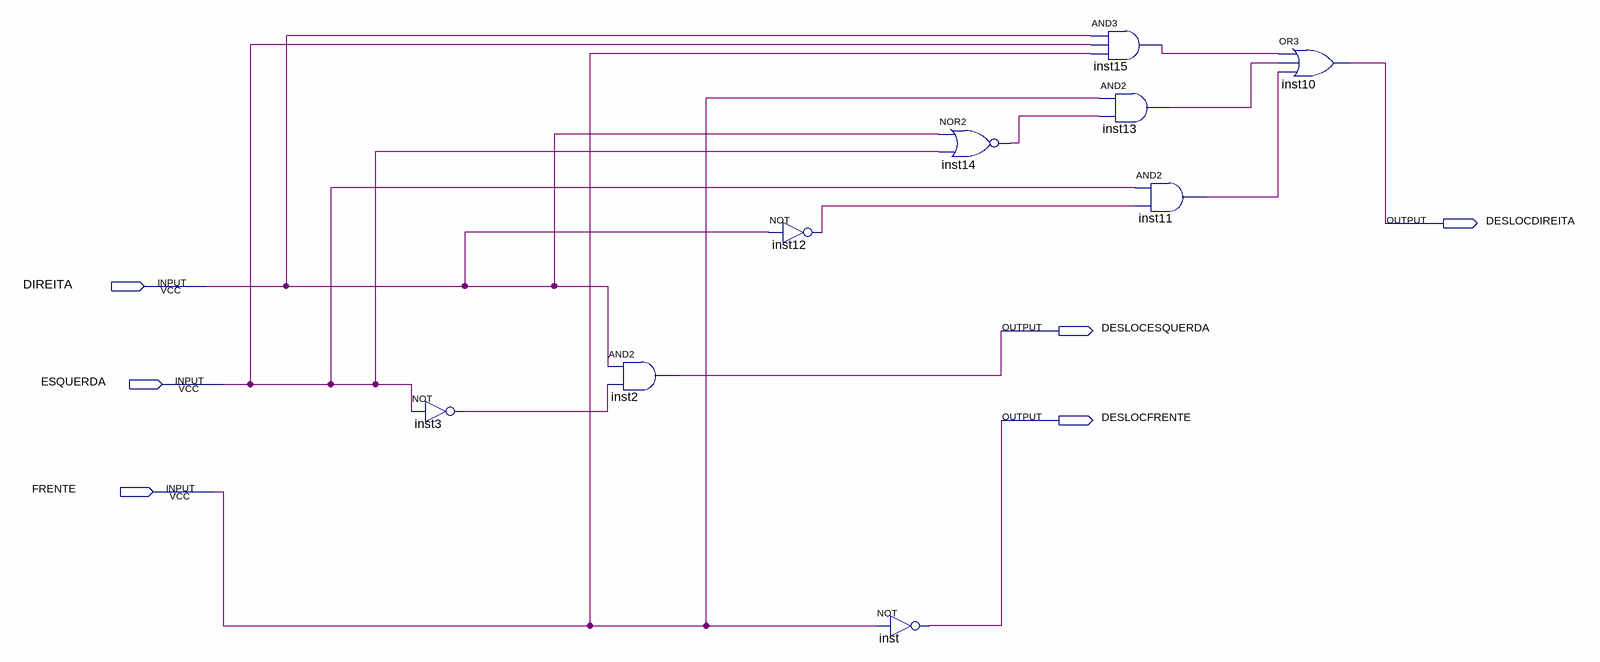
[diagram p0: schematic sheet]
// Quartus schematic Aula3.bdf as structural Verilog: 9 symbols, 6 pins
module Aula3 (
  input  DIREITA,
  input  ESQUERDA,
  input  FRENTE,
  output DESLOCDIREITA,
  output DESLOCESQUERDA,
  output DESLOCFRENTE
);

  wire inst3_out, inst11_out, inst12_out, inst13_out, inst14_out, inst15_out;

  not inst3 (inst3_out, ESQUERDA);
  and inst2 (DESLOCESQUERDA, DIREITA, inst3_out);
  not inst12 (inst12_out, DIREITA);
  nor inst14 (inst14_out, DIREITA, ESQUERDA);
  not inst (DESLOCFRENTE, FRENTE);
  and inst15 (inst15_out, DIREITA, ESQUERDA, FRENTE);
  and inst13 (inst13_out, FRENTE, inst14_out);
  and inst11 (inst11_out, ESQUERDA, inst12_out);
  or inst10 (DESLOCDIREITA, inst15_out, inst13_out, inst11_out);
endmodule
